# EAGLE design joystick-DAC-GPS (EAGLE 9.3.0)
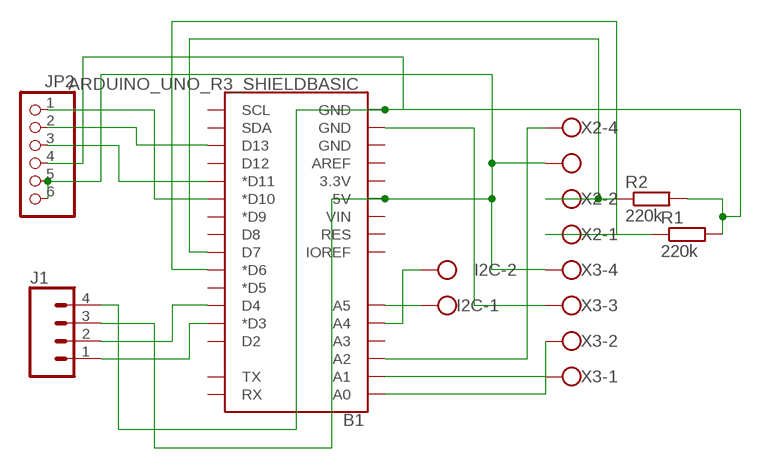
[diagram p0: schematic, sheet 1]

## Parts
B1  ARDUINO_UNO_R3_SHIELDBASIC  [UNO_R3_SHIELD]
I2C  W237-102  [W237-102]
J1  CONN_04  [1X04]
JP2  PINHD-1X6  [1X06]
R1  220k  R-EU_0204/7  [0204/7]
R2  220k  R-EU_0204/7  [0204/7]
X2  W237-4  [W237-4]
X3  W237-4  [W237-4]

## Nets
N$1: B1.5V J1.3 JP2.5 JP2.6 X2.3 X3.4
N$2: B1.A0 X3.2
N$3: B1.A1 X3.1
N$4: B1.GND@1(GND) X3.3
N$5: B1.GND@0(GND) J1.4 JP2.4 R1.2 R2.2
N$6: B1.A4 I2C.2
N$7: B1.A5 I2C.1
N$8: B1.A2 X2.4
N$9: B1.D10(*D10) JP2.1
N$10: B1.D7 R2.1 X2.2
N$12: B1.D11(*D11) JP2.3
N$13: B1.D13 JP2.2
N$15: B1.D6(*D6) R1.1 X2.1
N$16: B1.D3(*D3) J1.1
N$17: B1.D4 J1.2
Unconnected: B1.3.3V B1.A3 B1.AREF B1.D2 B1.D5(*D5) B1.D8 B1.D9(*D9) B1.D12 B1.GND@2(GND) B1.IOREF B1.RES B1.RX B1.SCL B1.SDA B1.TX B1.VIN

## Library data of the parts
B1 = SparkFun-Boards:ARDUINO_UNO_R3_SHIELD: Arduino R3 Shield Footprint Shield form compatible with the Arduino Uno R3. SparkFun Products: MG2639 Cellular Shield <https://www.sparkfun.com/products/13120> MIDI Shield <https://www.sparkfun.com/products/12898> R3 Stackable Headers Kit <https://www.sparkfun.com/products/11417>
I2C = con-wago-500:W237-102: WAGO SCREW CLAMP; MPN: 237-102; OC_FARNELL: unknown; OC_NEWARK: 70K9898
J1 = SparkFun-Connectors:CONN_04: Multi connection point. Often used as Generic Header-pin footprint for 0.1 inch spaced/style header connections On any of the 0.1 inch spaced packages, you can populate with these: Break Away Headers - Straight <https://www.sparkfun.com/products/116> (PRT-00116) Break Away Male Headers - Right Angle <https://www.sparkfun.com/products/553> (PRT-00553) Female Headers <https://www.sparkfun.com/products/115> (PRT-00115) Break Away Headers - Machine Pin <https://www.sparkfun.com/products/117> (PRT-00117) Break Away Female Headers - Swiss Machine Pin <https://www.sparkfun.com/products/743> (PRT-00743) For SCREWTERMINALS and SPRING TERMINALS visit here: Screw Terimnals on SparkFun.com <https://www.sparkfun.com/search/results?term=Screw+Terminals> (5mm/3.5mm/2.54mm spacing) This device is also useful as a general connection point to wire up your design to another part of your project. Our various solder wires solder well into these plated through hole pads. Hook-Up Wire - Assortment (Stranded, 22 AWG) <https://www.sparkfun.com/products/11375> (PRT-11375) Hook-Up Wire - Assortment (Solid Core, 22 AWG) <https://www.sparkfun.com/products/11367> (PRT-11367) View the entire wire category on our website here <https://www.sparkfun.com/categories/141> Special notes: Molex polarized connector foot print use with SKU : PRT-08231 with associated crimp pins and housings. 1MM SMD Version SKU: PRT-10208; PROD_ID: CONN-09696
JP2 = adafruit:PINHD-1X6: PIN HEADER
R1 R2 = rcl:R-EU_: RESISTOR, European symbol; SPICEPREFIX: R
X2 X3 = con-wago-500:W237-4: WAGO SCREW CLAMP; OC_FARNELL: unknown; OC_NEWARK: unknown

## Net classes
0 default: width 0.003 mm, drill 0.254 mm, clearance 0.152 mm

## Board
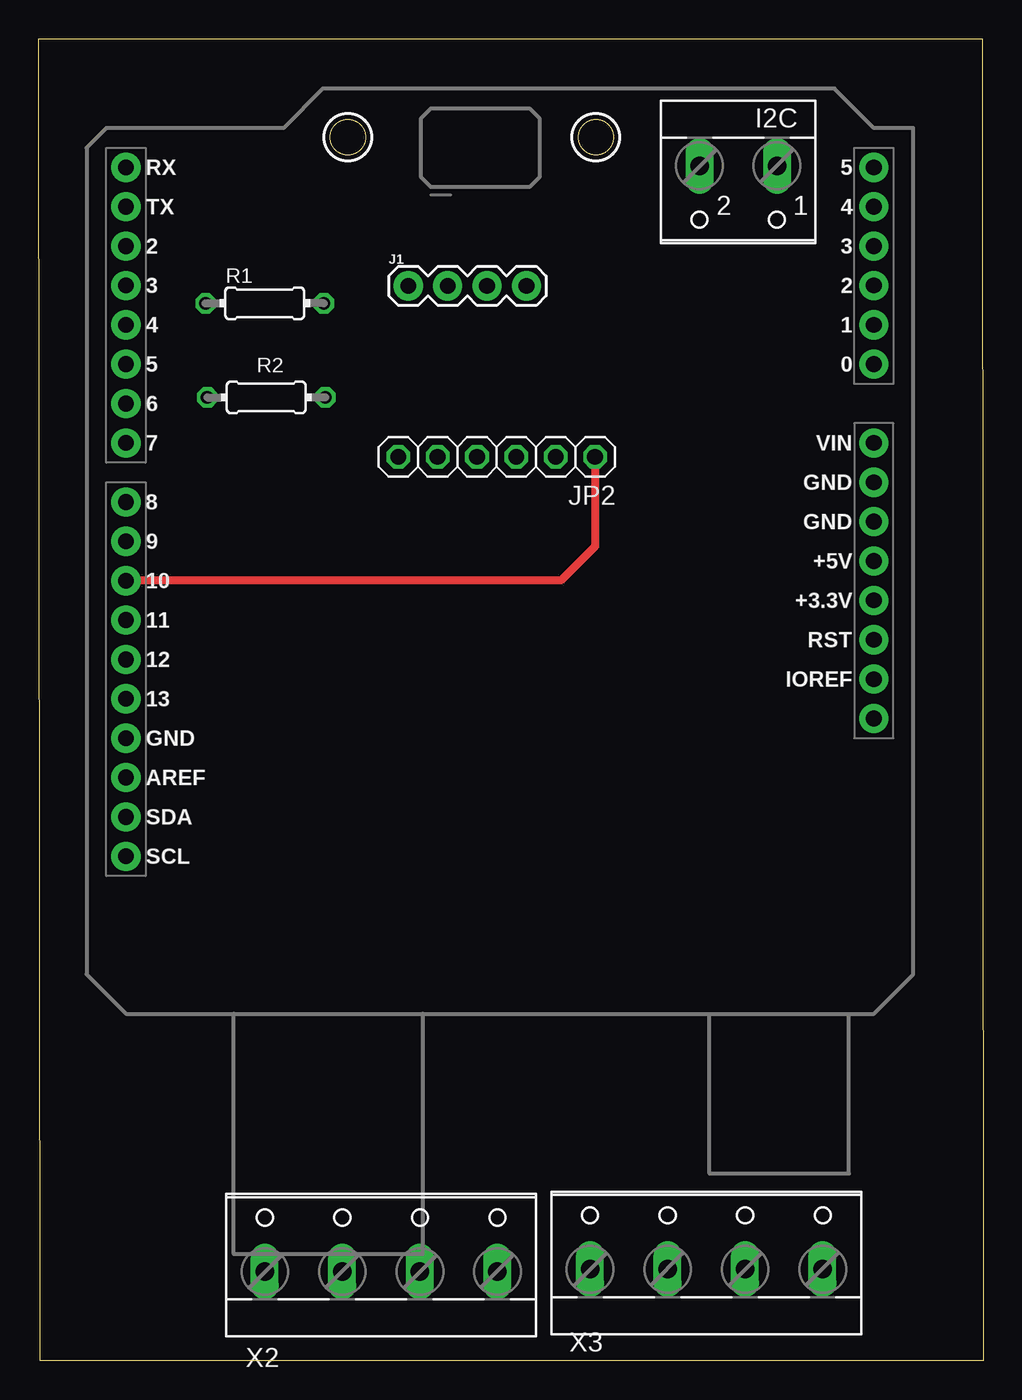
[diagram p1: board, top side]
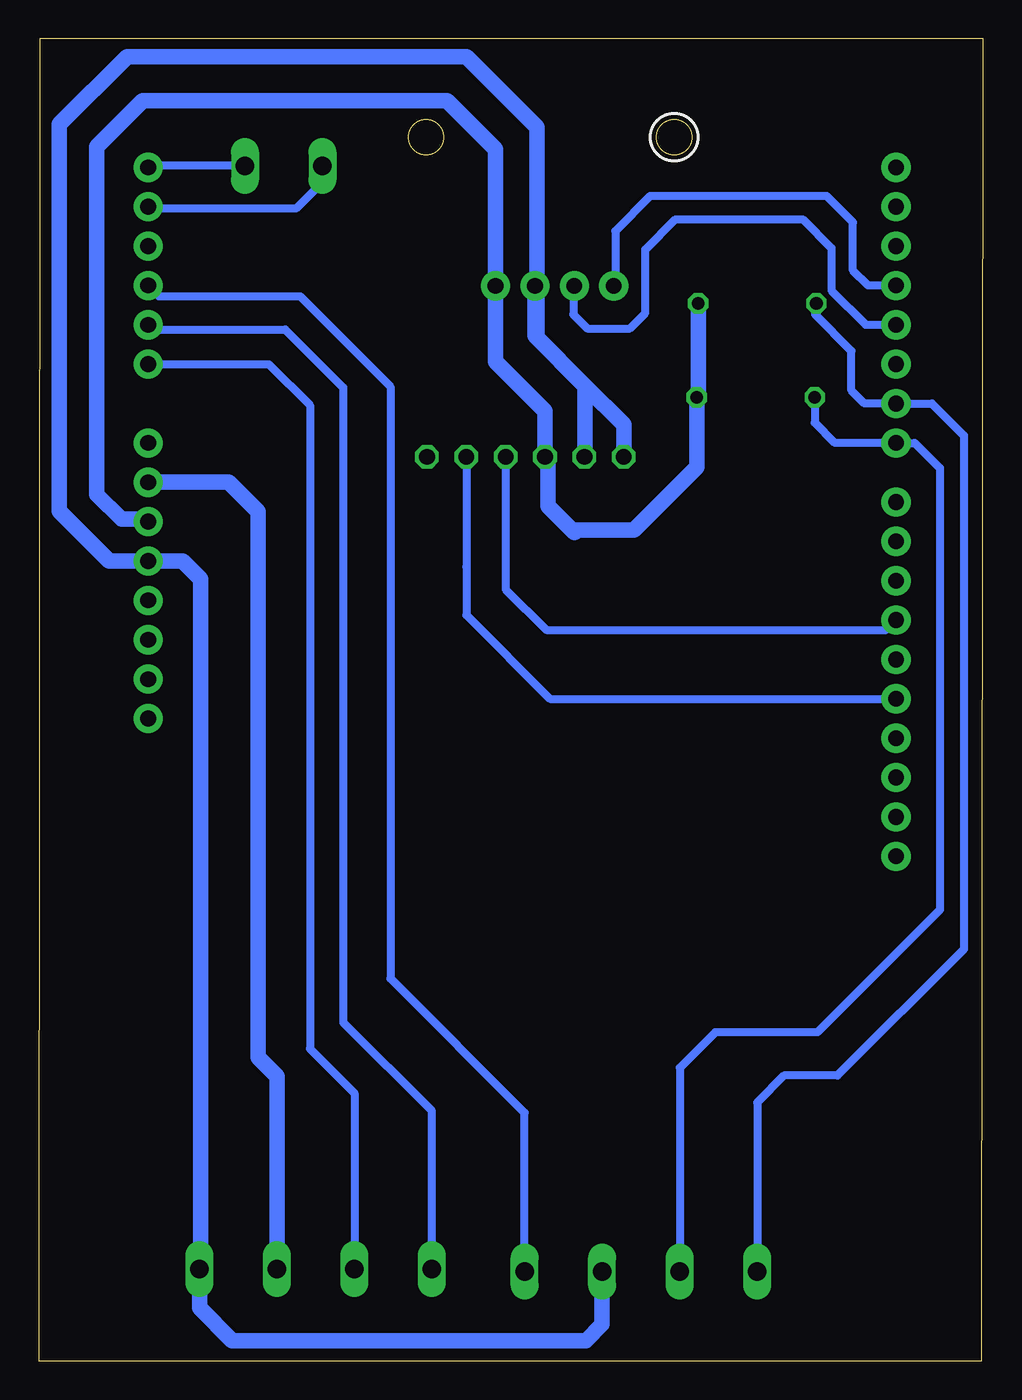
[diagram p2: board, bottom side, seen from below]

Size 60.95 x 85.3 mm. Coordinates in mm from the lower left corner, seen from the top.
Outline: 0,85.3 60.9,85.3 60.95,0 0.1,0 0,85.3
Outline: circle at 19.95,78.95 radius 1.14
Outline: circle at 35.95,78.95 radius 1.14
Copper layers (1*16): Top 0.018mm / dielectric 1.55mm / Bottom 0.018mm
Design rules "LPKF_GroepT(3)": minimum track width 0.5mm, minimum drill 0.6mm, track to track 0.2mm, track to pad 0.2mm, pad to pad 0.2mm, via to via 0.2mm, smd to smd 0mil, copper to edge 0.25mm, drill to drill 0.35mm, minimum pad ring 0.25mm, minimum via ring 0.5mm, stop-mask expansion 0mil, vias tented up to drill 0.45mm, thermal gap 0.2mm
tRestrict: area 18.4,77.4 to 21.5,80.5; area 34.4,77.4 to 37.5,80.5
bRestrict: area 18.4,77.4 to 21.5,80.5

### Footprints (pad centres in the part's own frame; a part is rotated, then mirrored left to right if it is on the bottom)
UNO_R3_SHIELD = drill 1.016 pad 1.88: 3.3V 24.13,-2.54; 5V 24.13,0; A0 24.13,12.7; A1 24.13,15.24; A2 24.13,17.78; A3 24.13,20.32; A4 24.13,22.86; A5 24.13,25.4; AREF -24.13,-13.97; D2 -24.13,20.32; D3 -24.13,17.78; D4 -24.13,15.24; D5 -24.13,12.7; D6 -24.13,10.16; D7 -24.13,7.62; D8 -24.13,3.81; D9 -24.13,1.27; D10 -24.13,-1.27; D11 -24.13,-3.81; D12 -24.13,-6.35; D13 -24.13,-8.89; GND@0 24.13,2.54; GND@1 24.13,5.08; GND@2 -24.13,-11.43; IOREF 24.13,-7.62; NC 24.13,-10.16; RES 24.13,-5.08; RX -24.13,25.4; SCL -24.13,-19.05; SDA -24.13,-16.51; TX -24.13,22.86; VIN 24.13,7.62
W237-102 = drill 1.194 long: 1 -2.5,-1.27; 2 2.5,-1.27
1X04 = drill 1.016 pad 1.88: 1 0,0; 2 2.54,0; 3 5.08,0; 4 7.62,0
1X06 = drill 1.016 octagon: 1 -6.35,0; 2 -3.81,0; 3 -1.27,0; 4 1.27,0; 5 3.81,0; 6 6.35,0
0204/7 = drill 0.813 octagon: 1 -3.81,0; 2 3.81,0
W237-4 = drill 1.194 long: 1 -7.5,-1.27; 2 -2.5,-1.27; 3 2.5,-1.27; 4 7.5,-1.27

### Placement (x,y rotation side)
B1  29.76,51.6 0 top
I2C  45.14,75.83 180 top
J1  23.85,69.35 0 top
JP2  29.55,58.32 180 top
R1  14.58,68.23 0 top
R2  14.68,62.16 0 top
X2  22.09,7.03 0 top
X3  43.08,7.18 0 top

### Tracks (layer width: path | path; a pad name or v marks a point on that pad's centre or on a via)
N$1
  Bottom 1: 28.93,66.13 25.7,62.9 | 25.7,62.9 25.7,58.36 JP2.5 | JP2.6 23.2,60.4 25.7,62.9 | X2.3 24.6,2.35 25.65,1.3 48.47,1.3 50.58,3.41 X3.4 50.5,5.99 50.5,50.45 51.65,51.6 B1.5V 56.42,51.6 59.63,54.81 59.63,79.77 55.25,84.15 33.35,84.15 28.8,79.6 28.8,66.26 28.93,66.13 | J1.3 28.93,66.13
N$2
  Bottom 0.5: B1.A0 46.1,64.3 43.45,61.65 43.45,20.13 40.58,17.26 X3.2
N$3
  Bottom 0.5: B1.A1 53.59,66.54 45.04,66.54 41.3,62.8 41.3,21.83 35.58,16.11 X3.1
N$4
  Bottom 1: B1.GND@1 48.68,56.68 46.8,54.8 46.8,19.58 45.58,18.36 X3.3
N$5
  Bottom 1: R1.2 18.39,62.26 R2.2 18.49,57.66 22.55,53.6 26.2,53.6 26.37,53.42 28.1,55.15 28.1,58.14 JP2.4 28.28,61.28 31.47,64.47 J1.4 31.47,78.18 34.59,81.3 54.25,81.3 57.2,78.35 57.2,55.9 55.6,54.3 54.05,54.3 B1.GND@0
N$6
  Bottom 0.5: I2C.2 42.64,76.06 44.35,74.35 53.78,74.35 B1.A4
N$7
  Bottom 0.5: I2C.1 53.79,77.1 B1.A5
N$8
  Bottom 0.5: B1.A2 53.19,68.68 44.08,68.68 38.25,62.85 38.25,24.67 29.59,16.01 X2.4
N$9
  Top 0.5: JP2.1 35.9,52.55 33.7,50.35 5.65,50.35 B1.D10
N$10
  Bottom 0.5: X2.2 19.59,18.91 17.3,21.2 10.7,21.2 2.8,29.1 2.8,57.6 4.42,59.22 B1.D7 9.57,59.22 10.87,60.52 R2.1
N$12
  Bottom 0.5: JP2.3 30.82,49.77 28.2,47.15 6.27,47.15 B1.D11
N$13
  Bottom 0.5: B1.D13 27.95,42.71 33.35,48.11 33.35,51.23 33.36,51.24 JP2.2
N$15
  Bottom 0.5: X2.1 14.59,16.66 12.85,18.4 9.4,18.4 1.25,26.55 1.25,59.7 3.31,61.76 B1.D6 7.66,61.76 8.5,62.6 8.5,65.15 10.85,67.5 10.85,68.15 R1.1
N$16
  Bottom 0.5: B1.D3 7.43,69.38 8.4,70.35 8.4,73.45 10.1,75.15 21.5,75.15 23.75,72.9 23.75,69.45 J1.1
N$17
  Bottom 0.5: J1.2 26.45,69.29 26.45,67.5 25.55,66.6 22.8,66.6 21.8,67.6 21.8,71.7 19.85,73.65 11.65,73.65 9.8,71.8 9.8,69.05 7.59,66.84 B1.D4